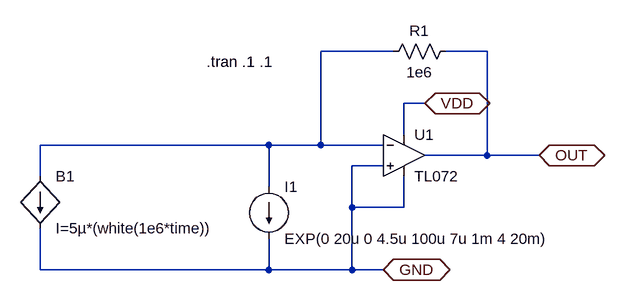
[diagram p0: schematic receptor_amp.asc]
receptor_amp.asc, the LTspice schematic file:
Version 4
SHEET 1 1052 680
WIRE 416 144 304 144
WIRE 560 144 496 144
WIRE 464 224 432 224
WIRE 432 272 432 224
WIRE 224 288 -128 288
WIRE 304 288 304 144
WIRE 304 288 224 288
WIRE 400 288 304 288
WIRE 560 304 560 144
WIRE 560 304 464 304
WIRE 640 304 560 304
WIRE 400 320 352 320
WIRE -128 336 -128 288
WIRE 224 352 224 288
WIRE 352 384 352 320
WIRE 432 384 432 336
WIRE 432 384 352 384
WIRE -128 480 -128 416
WIRE 224 480 224 432
WIRE 224 480 -128 480
WIRE 352 480 352 384
WIRE 352 480 224 480
WIRE 400 480 352 480
FLAG 400 480 GND
IOPIN 400 480 BiDir
FLAG 464 224 VDD
IOPIN 464 224 BiDir
FLAG 640 304 OUT
IOPIN 640 304 BiDir
SYMBOL Opamps/TL072 432 240 R0
SYMATTR InstName U1
SYMBOL res 512 128 R90
WINDOW 0 0 56 VBottom 2
WINDOW 3 32 56 VTop 2
SYMATTR InstName R1
SYMATTR Value 1e6
SYMBOL current 224 352 R0
SYMATTR InstName I1
SYMATTR Value EXP(0 20u 0 4.5u 100u 7u 1m 4 20m)
SYMBOL bi -128 336 R0
SYMATTR InstName B1
SYMATTR Value I=5µ*(white(1e6*time))
TEXT 128 160 Left 2 !.tran .1 .1

The netlist it stands for:
* receptor_amp.asc
XU1 GND N001 VDD GND OUT TL072  ; pins In+ In- V+ V- OUT
R1 OUT N001 1e6
I1 N001 GND EXP(0 20u 0 4.5u 100u 7u 1m 4 20m)
B1 N001 GND I=5µ*(white(1e6*time))
.tran .1 .1
.backanno
.end